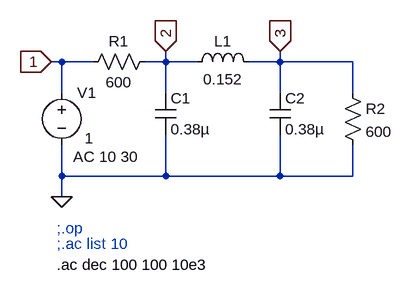
[diagram p0: schematic Chapter_4_circuit.asc]
Chapter_4_circuit.asc, the LTspice schematic file:
Version 4
SHEET 1 880 680
WIRE 16 80 0 80
WIRE 64 80 16 80
WIRE 176 80 176 64
WIRE 176 80 144 80
WIRE 224 80 176 80
WIRE 352 80 352 64
WIRE 352 80 304 80
WIRE 464 80 352 80
WIRE 16 128 16 80
WIRE 176 128 176 80
WIRE 352 128 352 80
WIRE 464 128 464 80
WIRE 16 256 16 208
WIRE 176 256 176 192
WIRE 176 256 16 256
WIRE 352 256 352 192
WIRE 352 256 176 256
WIRE 464 256 464 208
WIRE 464 256 352 256
WIRE 16 288 16 256
FLAG 16 288 0
FLAG 0 80 1
IOPIN 0 80 In
FLAG 176 64 2
IOPIN 176 64 In
FLAG 352 64 3
IOPIN 352 64 In
SYMBOL voltage 16 112 R0
WINDOW 3 35 86 Left 2
WINDOW 39 0 0 Left 0
WINDOW 123 18 114 Left 2
SYMATTR Value 1
SYMATTR InstName V1
SYMATTR Value2 AC 10 30
SYMBOL res 160 64 R90
WINDOW 0 0 56 VBottom 2
WINDOW 3 32 56 VTop 2
SYMATTR InstName R1
SYMATTR Value 600
SYMBOL res 448 112 R0
SYMATTR InstName R2
SYMATTR Value 600
SYMBOL cap 160 128 R0
SYMATTR InstName C1
SYMATTR Value 0.38µ
SYMBOL cap 336 128 R0
SYMATTR InstName C2
SYMATTR Value 0.38µ
SYMBOL ind 208 96 R270
WINDOW 0 32 56 VTop 2
WINDOW 3 5 56 VBottom 2
SYMATTR InstName L1
SYMATTR Value 0.152
TEXT 8 336 Left 2 ;;.op
TEXT 8 360 Left 2 ;;.ac list 10
TEXT 8 392 Left 2 !.ac dec 100 100 10e3

The netlist it stands for:
* Chapter_4_circuit.asc
V1 1 0 1 AC 10 30
R1 2 1 600
R2 3 0 600
C1 2 0 0.38µ
C2 3 0 0.38µ
L1 2 3 0.152
* ;.op
* ;.ac list 10
.ac dec 100 100 10e3
.backanno
.end